# Altium schematic sheet FMC_ADC_top.SchDoc: =ProjectTitle
size A3; DocumentNumber: 1; SheetNumber: 1; SheetTotal: 12
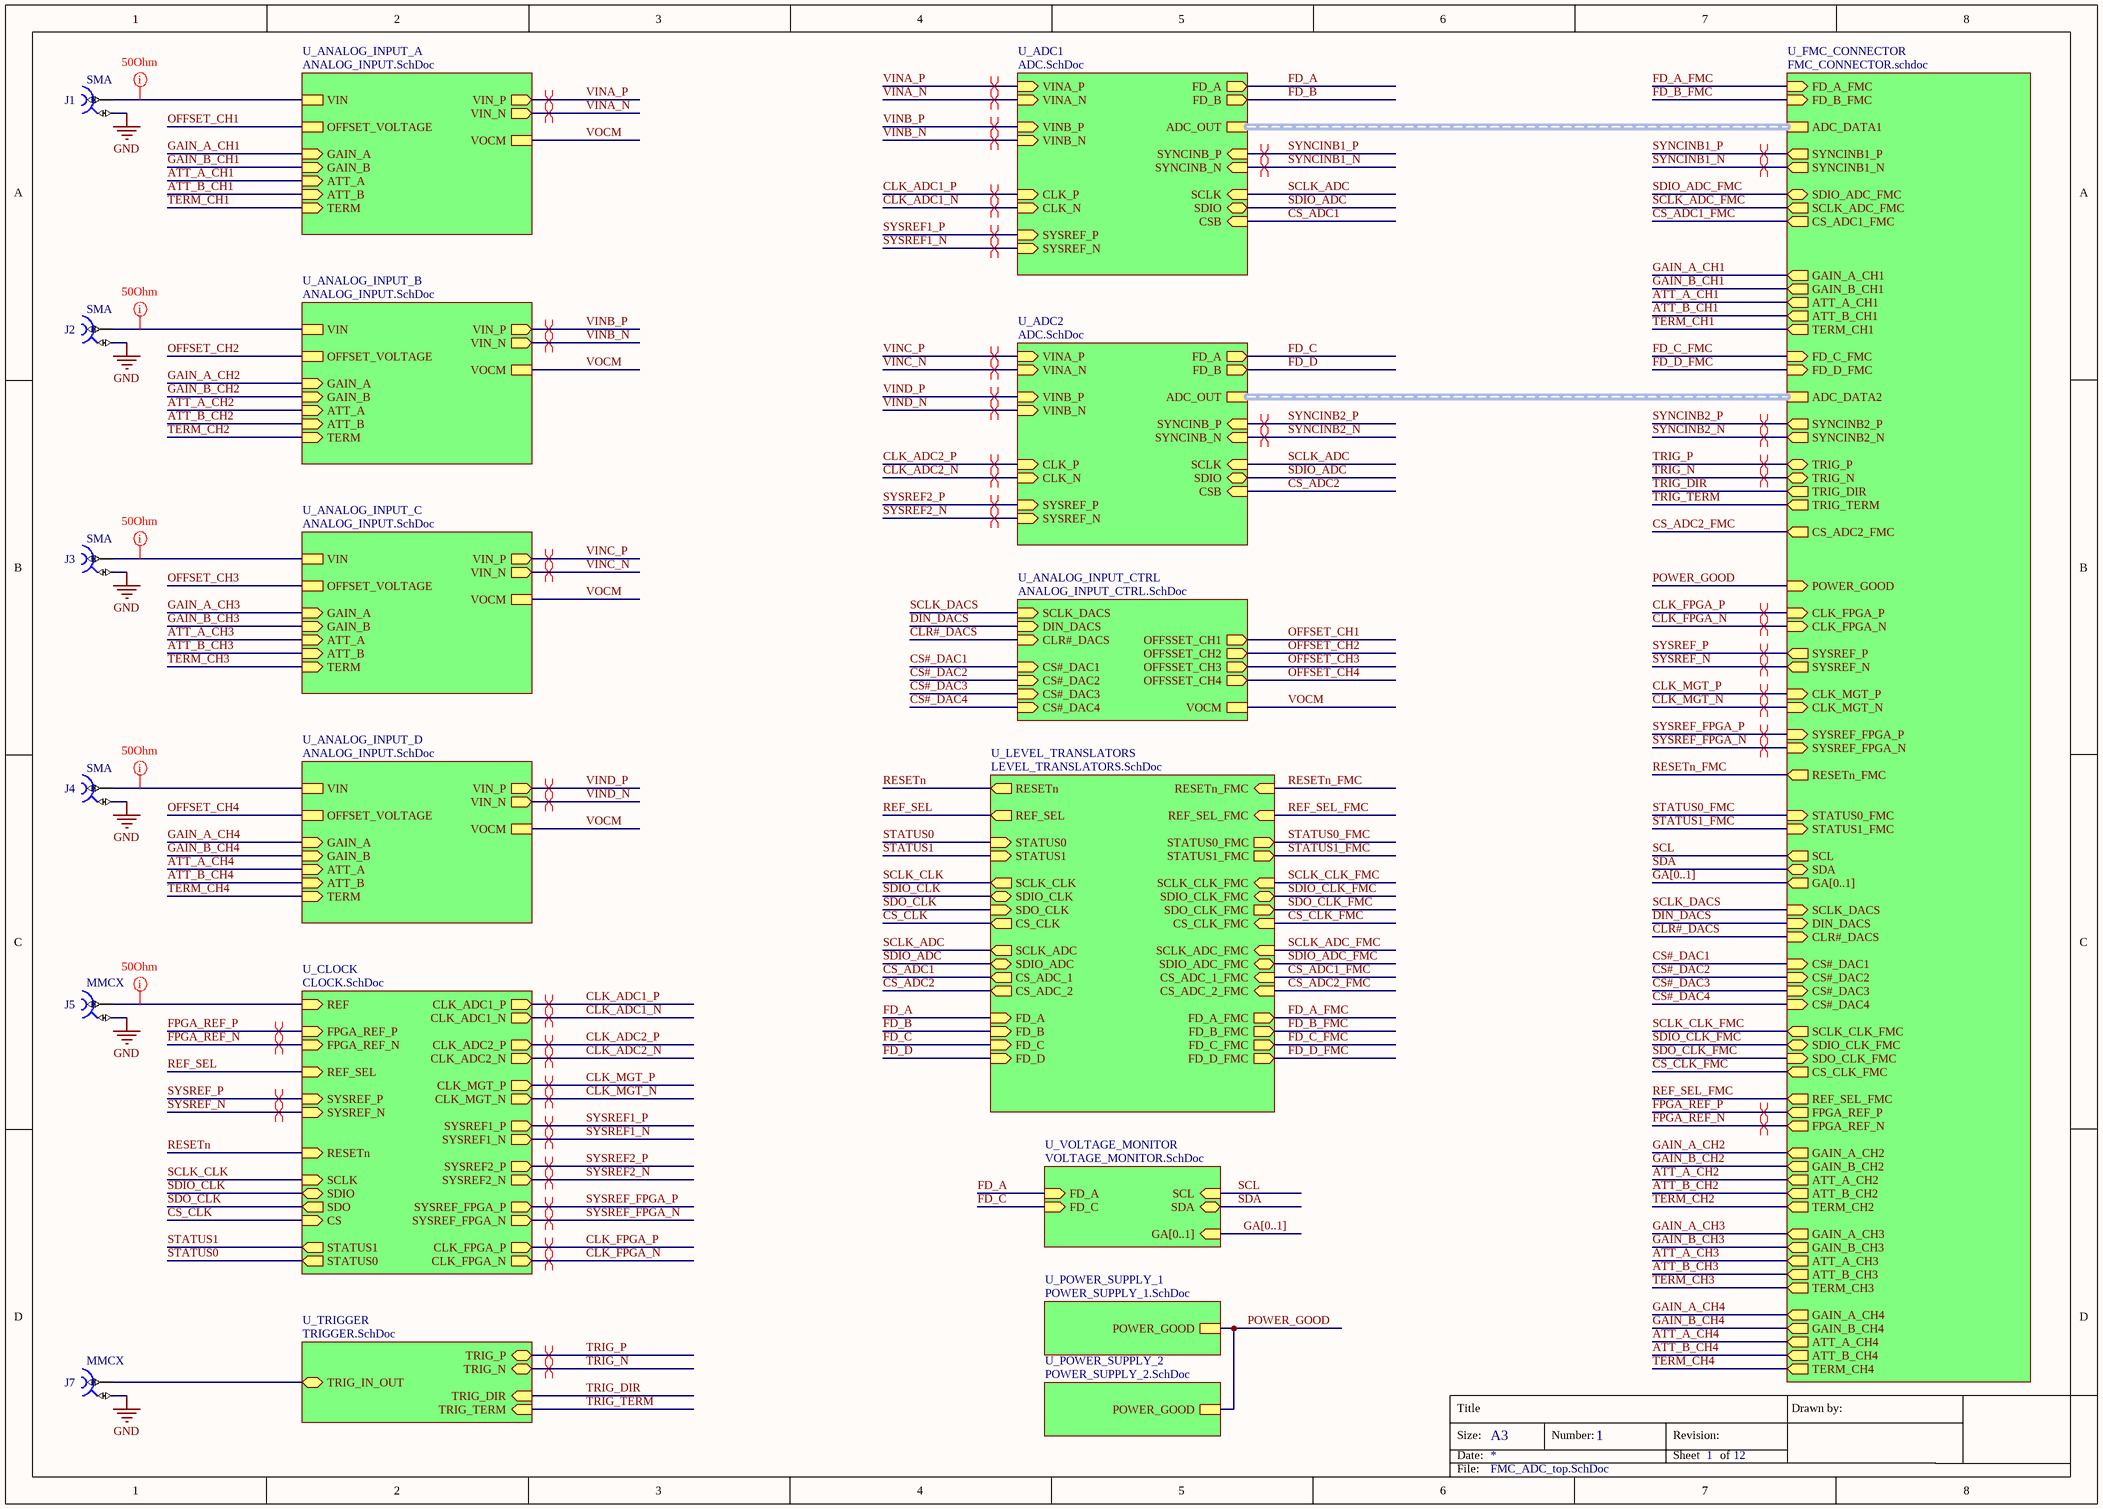
[diagram p0: FMC_ADC_top.SchDoc]

## Parts
J1  SMA  [HUBER-SUHNER_85_SMA-50-0-101/111_NE]
J2  SMA  [HUBER-SUHNER_85_SMA-50-0-101/111_NE]
J3  SMA  [HUBER-SUHNER_85_SMA-50-0-101/111_NE]
J4  SMA  [HUBER-SUHNER_85_SMA-50-0-101/111_NE]
J5  Family: MMCX  [HUBER-SUHNER_85_MMCX-50-0-1/111_OE]  (hidden comment: Coax_1Female_1Shield)
J7  Family: MMCX  [HUBER-SUHNER_85_MMCX-50-0-1/111_OE]  (hidden comment: Coax_1Female_1Shield)

## Sub-sheets
U_ADC1 = ADC.SchDoc: ADC_OUT (harness ADC_OUT), FD_A (out), FD_B (out), VINB_P (in), VINB_N (in), VINA_N (in), VINA_P (in), CLK_P (in), CLK_N (in), SYNCINB_N (in), SYSREF_P (in), SYNCINB_P (in), SYSREF_N (in), SDIO (bidir), SCLK (in), CSB (in)
U_ADC2 = ADC.SchDoc: ADC_OUT (harness ADC_OUT), FD_A (out), FD_B (out), VINB_P (in), VINB_N (in), VINA_N (in), VINA_P (in), CLK_P (in), CLK_N (in), SYNCINB_N (in), SYSREF_P (in), SYNCINB_P (in), SYSREF_N (in), SDIO (bidir), SCLK (in), CSB (in)
U_ANALOG_INPUT_A = ANALOG_INPUT.SchDoc: VIN_P (out), VIN_N (out), VIN, OFFSET_VOLTAGE, VOCM, GAIN_A (in), GAIN_B (in), ATT_B (in), ATT_A (in), TERM (in)
U_ANALOG_INPUT_B = ANALOG_INPUT.SchDoc: VIN_P (out), VIN_N (out), VIN, OFFSET_VOLTAGE, VOCM, GAIN_A (in), GAIN_B (in), ATT_B (in), ATT_A (in), TERM (in)
U_ANALOG_INPUT_C = ANALOG_INPUT.SchDoc: VIN_P (out), VIN_N (out), VIN, OFFSET_VOLTAGE, VOCM, GAIN_A (in), GAIN_B (in), ATT_B (in), ATT_A (in), TERM (in)
U_ANALOG_INPUT_CTRL = ANALOG_INPUT_CTRL.SchDoc: OFFSSET_CH1 (out), OFFSSET_CH2 (out), OFFSSET_CH3 (out), OFFSSET_CH4 (out), DIN_DACS (in), CS#_DAC1 (in), SCLK_DACS (in), CLR#_DACS (in), CS#_DAC2 (in), CS#_DAC3 (in), CS#_DAC4 (in), VOCM
U_ANALOG_INPUT_D = ANALOG_INPUT.SchDoc: VIN_P (out), VIN_N (out), VIN, OFFSET_VOLTAGE, VOCM, GAIN_A (in), GAIN_B (in), ATT_B (in), ATT_A (in), TERM (in)
U_CLOCK = CLOCK.SchDoc: REF (in), RESETn (in), SCLK (in), SDIO (bidir), CLK_FPGA_P (out), CLK_FPGA_N (out), CS (in), STATUS0 (out), STATUS1 (out), CLK_ADC1_P (out), CLK_ADC1_N (out), CLK_ADC2_P (out), CLK_ADC2_N (out), SDO (out), FPGA_REF_P (in), FPGA_REF_N (in), SYSREF_P (in), REF_SEL (in), SYSREF_N (in), SYSREF2_P (out), SYSREF1_P (out), SYSREF2_N (out), SYSREF1_N (out), SYSREF_FPGA_P (out), SYSREF_FPGA_N (out), CLK_MGT_N (out), CLK_MGT_P (out)
U_FMC_CONNECTOR = FMC_CONNECTOR.schdoc: ADC_DATA1 (harness ADC_OUT), SDIO_ADC_FMC (bidir), FD_A_FMC (in), SCLK_ADC_FMC (out), CS_ADC1_FMC (out), FD_B_FMC (in), SYSREF_P (out), SYSREF_N (out), CLK_MGT_P (in), SYSREF_FPGA_P (in), SYSREF_FPGA_N (in), CLK_MGT_N (in), SYNCINB1_P (out), SYNCINB1_N (out), SYNCINB2_N (out), SYNCINB2_P (out), ADC_DATA2 (harness ADC_OUT), STATUS0_FMC (in), RESETn_FMC (out), STATUS1_FMC (in), CS_CLK_FMC (out), FD_C_FMC (in), FD_D_FMC (in), CS_ADC2_FMC (out), CLK_FPGA_N (in), CLK_FPGA_P (in), SCL (out), SDA (bidir), GA[0..1] (out), TRIG_DIR (out), TRIG_P (bidir), TRIG_TERM (out), TRIG_N (bidir), CS#_DAC1 (in), SCLK_DACS (in), DIN_DACS (in), CLR#_DACS (in), CS#_DAC2 (in), CS#_DAC3 (in), CS#_DAC4 (in), SDIO_CLK_FMC (bidir), SCLK_CLK_FMC (out), SDO_CLK_FMC (in), REF_SEL_FMC (out), FPGA_REF_P (out), FPGA_REF_N (out), GAIN_A_CH1 (out), GAIN_B_CH1 (out), ATT_A_CH1 (out), ATT_B_CH1 (out), TERM_CH1 (out), GAIN_A_CH2 (out), GAIN_B_CH2 (out), ATT_A_CH2 (out), ATT_B_CH2 (out), TERM_CH2 (out), GAIN_A_CH3 (out), GAIN_B_CH3 (out), ATT_A_CH3 (out), ATT_B_CH3 (out), TERM_CH3 (out), GAIN_A_CH4 (out), GAIN_B_CH4 (out), ATT_A_CH4 (out), ATT_B_CH4 (out), TERM_CH4 (out), POWER_GOOD (in)
U_LEVEL_TRANSLATORS = LEVEL_TRANSLATORS.SchDoc: RESETn (out), CS_CLK (out), STATUS0 (in), STATUS1 (in), RESETn_FMC (in), STATUS0_FMC (out), STATUS1_FMC (out), CS_CLK_FMC (in), SCLK_CLK_FMC (in), SDIO_CLK_FMC (bidir), SCLK_CLK (out), SDIO_CLK (bidir), SDO_CLK (in), SDO_CLK_FMC (out), REF_SEL (out), REF_SEL_FMC (in), FD_C (in), FD_D (in), FD_A (in), FD_B (in), SCLK_ADC (out), SDIO_ADC (bidir), CS_ADC_1 (out), CS_ADC_2 (out), SCLK_ADC_FMC (in), SDIO_ADC_FMC (bidir), CS_ADC_1_FMC (in), CS_ADC_2_FMC (in), FD_C_FMC (out), FD_D_FMC (out), FD_A_FMC (out), FD_B_FMC (out)
U_POWER_SUPPLY_1 = POWER_SUPPLY_1.SchDoc: POWER_GOOD
U_POWER_SUPPLY_2 = POWER_SUPPLY_2.SchDoc: POWER_GOOD
U_TRIGGER = TRIGGER.SchDoc: TRIG_IN_OUT (bidir), TRIG_N (bidir), TRIG_P (bidir), TRIG_DIR (in), TRIG_TERM (in)
U_VOLTAGE_MONITOR = VOLTAGE_MONITOR.SchDoc: SDA (bidir), SCL (in), GA[0..1] (in), FD_A (in), FD_C (in)

## Nets
GND: J1.2 J2.2 J3.2 J4.2 J5.2 J7.2
ATT_A_CH1: sheet U_FMC_CONNECTOR/ATT_A_CH1, sheet U_ANALOG_INPUT_A/ATT_A
ATT_A_CH2: sheet U_FMC_CONNECTOR/ATT_A_CH2, sheet U_ANALOG_INPUT_B/ATT_A
ATT_A_CH3: sheet U_FMC_CONNECTOR/ATT_A_CH3, sheet U_ANALOG_INPUT_C/ATT_A
ATT_A_CH4: sheet U_FMC_CONNECTOR/ATT_A_CH4, sheet U_ANALOG_INPUT_D/ATT_A
ATT_B_CH1: sheet U_FMC_CONNECTOR/ATT_B_CH1, sheet U_ANALOG_INPUT_A/ATT_B
ATT_B_CH2: sheet U_FMC_CONNECTOR/ATT_B_CH2, sheet U_ANALOG_INPUT_B/ATT_B
ATT_B_CH3: sheet U_FMC_CONNECTOR/ATT_B_CH3, sheet U_ANALOG_INPUT_C/ATT_B
ATT_B_CH4: sheet U_FMC_CONNECTOR/ATT_B_CH4, sheet U_ANALOG_INPUT_D/ATT_B
CLK_ADC1_N: sheet U_CLOCK/CLK_ADC1_N, sheet U_ADC1/CLK_N
CLK_ADC1_P: sheet U_CLOCK/CLK_ADC1_P, sheet U_ADC1/CLK_P
CLK_ADC2_N: sheet U_ADC2/CLK_N, sheet U_CLOCK/CLK_ADC2_N
CLK_ADC2_P: sheet U_ADC2/CLK_P, sheet U_CLOCK/CLK_ADC2_P
CLK_FPGA_N: sheet U_FMC_CONNECTOR/CLK_FPGA_N, sheet U_CLOCK/CLK_FPGA_N
CLK_FPGA_P: sheet U_FMC_CONNECTOR/CLK_FPGA_P, sheet U_CLOCK/CLK_FPGA_P
CLK_MGT_N: sheet U_FMC_CONNECTOR/CLK_MGT_N, sheet U_CLOCK/CLK_MGT_N
CLK_MGT_P: sheet U_FMC_CONNECTOR/CLK_MGT_P, sheet U_CLOCK/CLK_MGT_P
CLR#_DACS: sheet U_FMC_CONNECTOR/CLR#_DACS, sheet U_ANALOG_INPUT_CTRL/CLR#_DACS
CS#_DAC1: sheet U_FMC_CONNECTOR/CS#_DAC1, sheet U_ANALOG_INPUT_CTRL/CS#_DAC1
CS#_DAC2: sheet U_FMC_CONNECTOR/CS#_DAC2, sheet U_ANALOG_INPUT_CTRL/CS#_DAC2
CS#_DAC3: sheet U_FMC_CONNECTOR/CS#_DAC3, sheet U_ANALOG_INPUT_CTRL/CS#_DAC3
CS#_DAC4: sheet U_FMC_CONNECTOR/CS#_DAC4, sheet U_ANALOG_INPUT_CTRL/CS#_DAC4
CS_ADC1: sheet U_ADC1/CSB, sheet U_LEVEL_TRANSLATORS/CS_ADC_1
CS_ADC1_FMC: sheet U_FMC_CONNECTOR/CS_ADC1_FMC, sheet U_LEVEL_TRANSLATORS/CS_ADC_1_FMC
CS_ADC2: sheet U_ADC2/CSB, sheet U_LEVEL_TRANSLATORS/CS_ADC_2
CS_ADC2_FMC: sheet U_FMC_CONNECTOR/CS_ADC2_FMC, sheet U_LEVEL_TRANSLATORS/CS_ADC_2_FMC
CS_CLK: sheet U_CLOCK/CS, sheet U_LEVEL_TRANSLATORS/CS_CLK
CS_CLK_FMC: sheet U_FMC_CONNECTOR/CS_CLK_FMC, sheet U_LEVEL_TRANSLATORS/CS_CLK_FMC
DIN_DACS: sheet U_FMC_CONNECTOR/DIN_DACS, sheet U_ANALOG_INPUT_CTRL/DIN_DACS
FD_A: sheet U_ADC1/FD_A, sheet U_LEVEL_TRANSLATORS/FD_A, sheet U_VOLTAGE_MONITOR/FD_A
FD_A_FMC: sheet U_FMC_CONNECTOR/FD_A_FMC, sheet U_LEVEL_TRANSLATORS/FD_A_FMC
FD_B: sheet U_ADC1/FD_B, sheet U_LEVEL_TRANSLATORS/FD_B
FD_B_FMC: sheet U_FMC_CONNECTOR/FD_B_FMC, sheet U_LEVEL_TRANSLATORS/FD_B_FMC
FD_C: sheet U_ADC2/FD_A, sheet U_LEVEL_TRANSLATORS/FD_C, sheet U_VOLTAGE_MONITOR/FD_C
FD_C_FMC: sheet U_FMC_CONNECTOR/FD_C_FMC, sheet U_LEVEL_TRANSLATORS/FD_C_FMC
FD_D: sheet U_ADC2/FD_B, sheet U_LEVEL_TRANSLATORS/FD_D
FD_D_FMC: sheet U_FMC_CONNECTOR/FD_D_FMC, sheet U_LEVEL_TRANSLATORS/FD_D_FMC
FPGA_REF_N: sheet U_FMC_CONNECTOR/FPGA_REF_N, sheet U_CLOCK/FPGA_REF_N
FPGA_REF_P: sheet U_FMC_CONNECTOR/FPGA_REF_P, sheet U_CLOCK/FPGA_REF_P
GAIN_A_CH1: sheet U_FMC_CONNECTOR/GAIN_A_CH1, sheet U_ANALOG_INPUT_A/GAIN_A
GAIN_A_CH2: sheet U_FMC_CONNECTOR/GAIN_A_CH2, sheet U_ANALOG_INPUT_B/GAIN_A
GAIN_A_CH3: sheet U_FMC_CONNECTOR/GAIN_A_CH3, sheet U_ANALOG_INPUT_C/GAIN_A
GAIN_A_CH4: sheet U_FMC_CONNECTOR/GAIN_A_CH4, sheet U_ANALOG_INPUT_D/GAIN_A
GAIN_B_CH1: sheet U_FMC_CONNECTOR/GAIN_B_CH1, sheet U_ANALOG_INPUT_A/GAIN_B
GAIN_B_CH2: sheet U_FMC_CONNECTOR/GAIN_B_CH2, sheet U_ANALOG_INPUT_B/GAIN_B
GAIN_B_CH3: sheet U_FMC_CONNECTOR/GAIN_B_CH3, sheet U_ANALOG_INPUT_C/GAIN_B
GAIN_B_CH4: sheet U_FMC_CONNECTOR/GAIN_B_CH4, sheet U_ANALOG_INPUT_D/GAIN_B
OFFSET_CH1: sheet U_ANALOG_INPUT_A/OFFSET_VOLTAGE, sheet U_ANALOG_INPUT_CTRL/OFFSSET_CH1
OFFSET_CH2: sheet U_ANALOG_INPUT_B/OFFSET_VOLTAGE, sheet U_ANALOG_INPUT_CTRL/OFFSSET_CH2
OFFSET_CH3: sheet U_ANALOG_INPUT_C/OFFSET_VOLTAGE, sheet U_ANALOG_INPUT_CTRL/OFFSSET_CH3
OFFSET_CH4: sheet U_ANALOG_INPUT_D/OFFSET_VOLTAGE, sheet U_ANALOG_INPUT_CTRL/OFFSSET_CH4
POWER_GOOD: sheet U_FMC_CONNECTOR/POWER_GOOD, sheet U_POWER_SUPPLY_1/POWER_GOOD, sheet U_POWER_SUPPLY_2/POWER_GOOD
REF_SEL: sheet U_CLOCK/REF_SEL, sheet U_LEVEL_TRANSLATORS/REF_SEL
REF_SEL_FMC: sheet U_FMC_CONNECTOR/REF_SEL_FMC, sheet U_LEVEL_TRANSLATORS/REF_SEL_FMC
RESETn: sheet U_CLOCK/RESETn, sheet U_LEVEL_TRANSLATORS/RESETn
RESETn_FMC: sheet U_FMC_CONNECTOR/RESETn_FMC, sheet U_LEVEL_TRANSLATORS/RESETn_FMC
SCL: sheet U_FMC_CONNECTOR/SCL, sheet U_VOLTAGE_MONITOR/SCL
SCLK_ADC: sheet U_ADC2/SCLK, sheet U_ADC1/SCLK, sheet U_LEVEL_TRANSLATORS/SCLK_ADC
SCLK_ADC_FMC: sheet U_FMC_CONNECTOR/SCLK_ADC_FMC, sheet U_LEVEL_TRANSLATORS/SCLK_ADC_FMC
SCLK_CLK: sheet U_CLOCK/SCLK, sheet U_LEVEL_TRANSLATORS/SCLK_CLK
SCLK_CLK_FMC: sheet U_FMC_CONNECTOR/SCLK_CLK_FMC, sheet U_LEVEL_TRANSLATORS/SCLK_CLK_FMC
SCLK_DACS: sheet U_FMC_CONNECTOR/SCLK_DACS, sheet U_ANALOG_INPUT_CTRL/SCLK_DACS
SDA: sheet U_FMC_CONNECTOR/SDA, sheet U_VOLTAGE_MONITOR/SDA
SDIO_ADC: sheet U_ADC2/SDIO, sheet U_ADC1/SDIO, sheet U_LEVEL_TRANSLATORS/SDIO_ADC
SDIO_ADC_FMC: sheet U_FMC_CONNECTOR/SDIO_ADC_FMC, sheet U_LEVEL_TRANSLATORS/SDIO_ADC_FMC
SDIO_CLK: sheet U_CLOCK/SDIO, sheet U_LEVEL_TRANSLATORS/SDIO_CLK
SDIO_CLK_FMC: sheet U_FMC_CONNECTOR/SDIO_CLK_FMC, sheet U_LEVEL_TRANSLATORS/SDIO_CLK_FMC
SDO_CLK: sheet U_CLOCK/SDO, sheet U_LEVEL_TRANSLATORS/SDO_CLK
SDO_CLK_FMC: sheet U_FMC_CONNECTOR/SDO_CLK_FMC, sheet U_LEVEL_TRANSLATORS/SDO_CLK_FMC
STATUS0: sheet U_CLOCK/STATUS0, sheet U_LEVEL_TRANSLATORS/STATUS0
STATUS0_FMC: sheet U_FMC_CONNECTOR/STATUS0_FMC, sheet U_LEVEL_TRANSLATORS/STATUS0_FMC
STATUS1: sheet U_CLOCK/STATUS1, sheet U_LEVEL_TRANSLATORS/STATUS1
STATUS1_FMC: sheet U_FMC_CONNECTOR/STATUS1_FMC, sheet U_LEVEL_TRANSLATORS/STATUS1_FMC
SYNCINB1_N: sheet U_FMC_CONNECTOR/SYNCINB1_N, sheet U_ADC1/SYNCINB_N
SYNCINB1_P: sheet U_FMC_CONNECTOR/SYNCINB1_P, sheet U_ADC1/SYNCINB_P
SYNCINB2_N: sheet U_FMC_CONNECTOR/SYNCINB2_N, sheet U_ADC2/SYNCINB_N
SYNCINB2_P: sheet U_FMC_CONNECTOR/SYNCINB2_P, sheet U_ADC2/SYNCINB_P
SYSREF1_N: sheet U_CLOCK/SYSREF1_N, sheet U_ADC1/SYSREF_N
SYSREF1_P: sheet U_CLOCK/SYSREF1_P, sheet U_ADC1/SYSREF_P
SYSREF2_N: sheet U_ADC2/SYSREF_N, sheet U_CLOCK/SYSREF2_N
SYSREF2_P: sheet U_ADC2/SYSREF_P, sheet U_CLOCK/SYSREF2_P
SYSREF_FPGA_N: sheet U_FMC_CONNECTOR/SYSREF_FPGA_N, sheet U_CLOCK/SYSREF_FPGA_N
SYSREF_FPGA_P: sheet U_FMC_CONNECTOR/SYSREF_FPGA_P, sheet U_CLOCK/SYSREF_FPGA_P
SYSREF_N: sheet U_FMC_CONNECTOR/SYSREF_N, sheet U_CLOCK/SYSREF_N
SYSREF_P: sheet U_FMC_CONNECTOR/SYSREF_P, sheet U_CLOCK/SYSREF_P
TERM_CH1: sheet U_FMC_CONNECTOR/TERM_CH1, sheet U_ANALOG_INPUT_A/TERM
TERM_CH2: sheet U_FMC_CONNECTOR/TERM_CH2, sheet U_ANALOG_INPUT_B/TERM
TERM_CH3: sheet U_FMC_CONNECTOR/TERM_CH3, sheet U_ANALOG_INPUT_C/TERM
TERM_CH4: sheet U_FMC_CONNECTOR/TERM_CH4, sheet U_ANALOG_INPUT_D/TERM
TRIG_DIR: sheet U_FMC_CONNECTOR/TRIG_DIR, sheet U_TRIGGER/TRIG_DIR
TRIG_N: sheet U_FMC_CONNECTOR/TRIG_N, sheet U_TRIGGER/TRIG_N
TRIG_P: sheet U_FMC_CONNECTOR/TRIG_P, sheet U_TRIGGER/TRIG_P
TRIG_TERM: sheet U_FMC_CONNECTOR/TRIG_TERM, sheet U_TRIGGER/TRIG_TERM
VINA_N: sheet U_ADC1/VINA_N, sheet U_ANALOG_INPUT_A/VIN_N
VINA_P: sheet U_ADC1/VINA_P, sheet U_ANALOG_INPUT_A/VIN_P
VINB_N: sheet U_ADC1/VINB_N, sheet U_ANALOG_INPUT_B/VIN_N
VINB_P: sheet U_ADC1/VINB_P, sheet U_ANALOG_INPUT_B/VIN_P
VINC_N: sheet U_ADC2/VINA_N, sheet U_ANALOG_INPUT_C/VIN_N
VINC_P: sheet U_ADC2/VINA_P, sheet U_ANALOG_INPUT_C/VIN_P
VIND_N: sheet U_ADC2/VINB_N, sheet U_ANALOG_INPUT_D/VIN_N
VIND_P: sheet U_ADC2/VINB_P, sheet U_ANALOG_INPUT_D/VIN_P
VOCM: sheet U_ANALOG_INPUT_D/VOCM, sheet U_ANALOG_INPUT_C/VOCM, sheet U_ANALOG_INPUT_B/VOCM, sheet U_ANALOG_INPUT_A/VOCM, sheet U_ANALOG_INPUT_CTRL/VOCM
NetJ1_1: J1.1 ; sheet U_ANALOG_INPUT_A/VIN
NetJ2_1: J2.1 ; sheet U_ANALOG_INPUT_B/VIN
NetJ3_1: J3.1 ; sheet U_ANALOG_INPUT_C/VIN
NetJ4_1: J4.1 ; sheet U_ANALOG_INPUT_D/VIN
NetJ5_1: J5.1 ; sheet U_CLOCK/REF
NetJ7_1: J7.1 ; sheet U_TRIGGER/TRIG_IN_OUT

## Buses and harness runs
bus GA[0..1] = sheet U_FMC_CONNECTOR/GA[0..1]
bus GA[0..1] = sheet U_VOLTAGE_MONITOR/GA[0..1]
harness sheet U_ADC1/ADC_OUT = sheet U_FMC_CONNECTOR/ADC_DATA1
harness sheet U_ADC2/ADC_OUT = sheet U_FMC_CONNECTOR/ADC_DATA2

## Layout directives
differential pair: CLK_ADC1_N, CLK_ADC1_P, CLK_ADC2_N, CLK_ADC2_P, CLK_FPGA_N, CLK_FPGA_P, CLK_MGT_N, CLK_MGT_P, FPGA_REF_N, FPGA_REF_P, SYNCINB1_N, SYNCINB1_P, SYNCINB2_N, SYNCINB2_P, SYSREF1_N, SYSREF1_P, SYSREF2_N, SYSREF2_P, SYSREF_FPGA_N, SYSREF_FPGA_P, SYSREF_N, SYSREF_P, TRIG_N, TRIG_P, VINA_N, VINA_P, VINB_N, VINB_P, VINC_N, VINC_P, VIND_N, VIND_P
net class 50Ohm: NetJ1_1, NetJ2_1, NetJ3_1, NetJ4_1, NetJ5_1

## Notes on the sheet
- Title
- Size:
- Date:
- A3
- Number:
- Revision:
- Sheet
- of
- Drawn by:
- File:

## Library data of the parts
J1-J4 = HUBER-SUHNER_85_SMA-50-0-101/111_NE: Part Description: SMA 50 Ohms Right Angle PCB Jack; Manufacturer: HUBER+SUHNER; PressFit: No; Part Number: HUBER-SUHNER_85_SMA-50-0-101/111_NE; Component Kind: Standard; Component Type: Standard; Footprint: HUBER-SUHNER_85 SMA-50-0-101/111_NE; Pin Count: 2; Family: SMA; Mounted: Yes; Socket: No; SMD: No; Sense: No; Status: None; Manufacturer Part Number: 85_SMA-50-0-101/111_NE; ComponentHeight: 9.6mm; HelpURL: \\cern.ch\dfs\Applications\Altium\Datasheets\HUBER-SUHNER_85_SMA-50-0-101-111_NE.pdf; Author: CERN DEM JLC; CreateDate: 20.04.2010; LatestRevisionDate: 06.11.2014
J5 J7 = HUBER-SUHNER_85_MMCX-50-0-1/111_OE: Part Description: MMCX 50 Ohms Right Angle PCB Jack; Manufacturer: HUBER+SUHNER; PressFit: No; Part Number: HUBER-SUHNER_85_MMCX-50-0-1/111_OE; Component Kind: Standard; Component Type: Standard; Pin Count: 2; Mounted: Yes; Socket: No; SMD: No; Sense: No; Status: None; Manufacturer Part Number: 85_MMCX-50-0-1/111_OE; ComponentHeight: 9.6mm; HelpURL: \\cern.ch\dfs\Applications\Altium\Datasheets\HUBER-SUHNER_85_MMCX-50-0-1-111_OE.pdf; Author: CERN DEM JLC; CreateDate: 06.11.2014; LatestRevisionDate: 06.11.2014